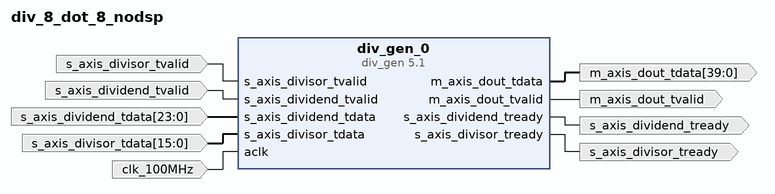
[diagram p0: block diagram of the top level]
# Vivado block design div_8_dot_8_nodsp, xc7a100tcsg324-1, Vivado 2019.1
create_bd_design div_8_dot_8_nodsp

create_bd_port -dir I -type clk clk_100MHz
set_property -dict {CONFIG.FREQ_HZ 100000000} [get_bd_ports clk_100MHz]
create_bd_port -dir I s_axis_divisor_tvalid
create_bd_port -dir I s_axis_dividend_tvalid
create_bd_port -dir I -from 23 -to 0 s_axis_dividend_tdata
create_bd_port -dir I -from 15 -to 0 -type data s_axis_divisor_tdata
create_bd_port -dir O s_axis_divisor_tready
create_bd_port -dir O m_axis_dout_tvalid
create_bd_port -dir O -from 39 -to 0 m_axis_dout_tdata
create_bd_port -dir O s_axis_dividend_tready

create_bd_cell -type ip -vlnv xilinx.com:ip:div_gen:5.1 div_gen_0
set_property -dict [list \
  CONFIG.clocks_per_division 4 \
  CONFIG.dividend_and_quotient_width 24 \
  CONFIG.fractional_width 16 \
  CONFIG.latency 45 \
  CONFIG.remainder_type Fractional \
] [get_bd_cells div_gen_0]

# ---- connections ----

connect_bd_net [get_bd_ports s_axis_divisor_tvalid] [get_bd_pins div_gen_0/s_axis_divisor_tvalid]
connect_bd_net [get_bd_ports s_axis_dividend_tvalid] [get_bd_pins div_gen_0/s_axis_dividend_tvalid]
connect_bd_net [get_bd_ports s_axis_dividend_tdata] [get_bd_pins div_gen_0/s_axis_dividend_tdata]
connect_bd_net [get_bd_ports s_axis_divisor_tdata] [get_bd_pins div_gen_0/s_axis_divisor_tdata]
connect_bd_net [get_bd_pins div_gen_0/m_axis_dout_tvalid] [get_bd_ports m_axis_dout_tvalid]
connect_bd_net [get_bd_pins div_gen_0/m_axis_dout_tdata] [get_bd_ports m_axis_dout_tdata]
connect_bd_net [get_bd_pins div_gen_0/s_axis_dividend_tready] [get_bd_ports s_axis_dividend_tready]
connect_bd_net [get_bd_pins div_gen_0/s_axis_divisor_tready] [get_bd_ports s_axis_divisor_tready]
connect_bd_net [get_bd_ports clk_100MHz] [get_bd_pins div_gen_0/aclk]

validate_bd_design
save_bd_design
